# EAGLE design ESRMeterP (EAGLE 4.11)
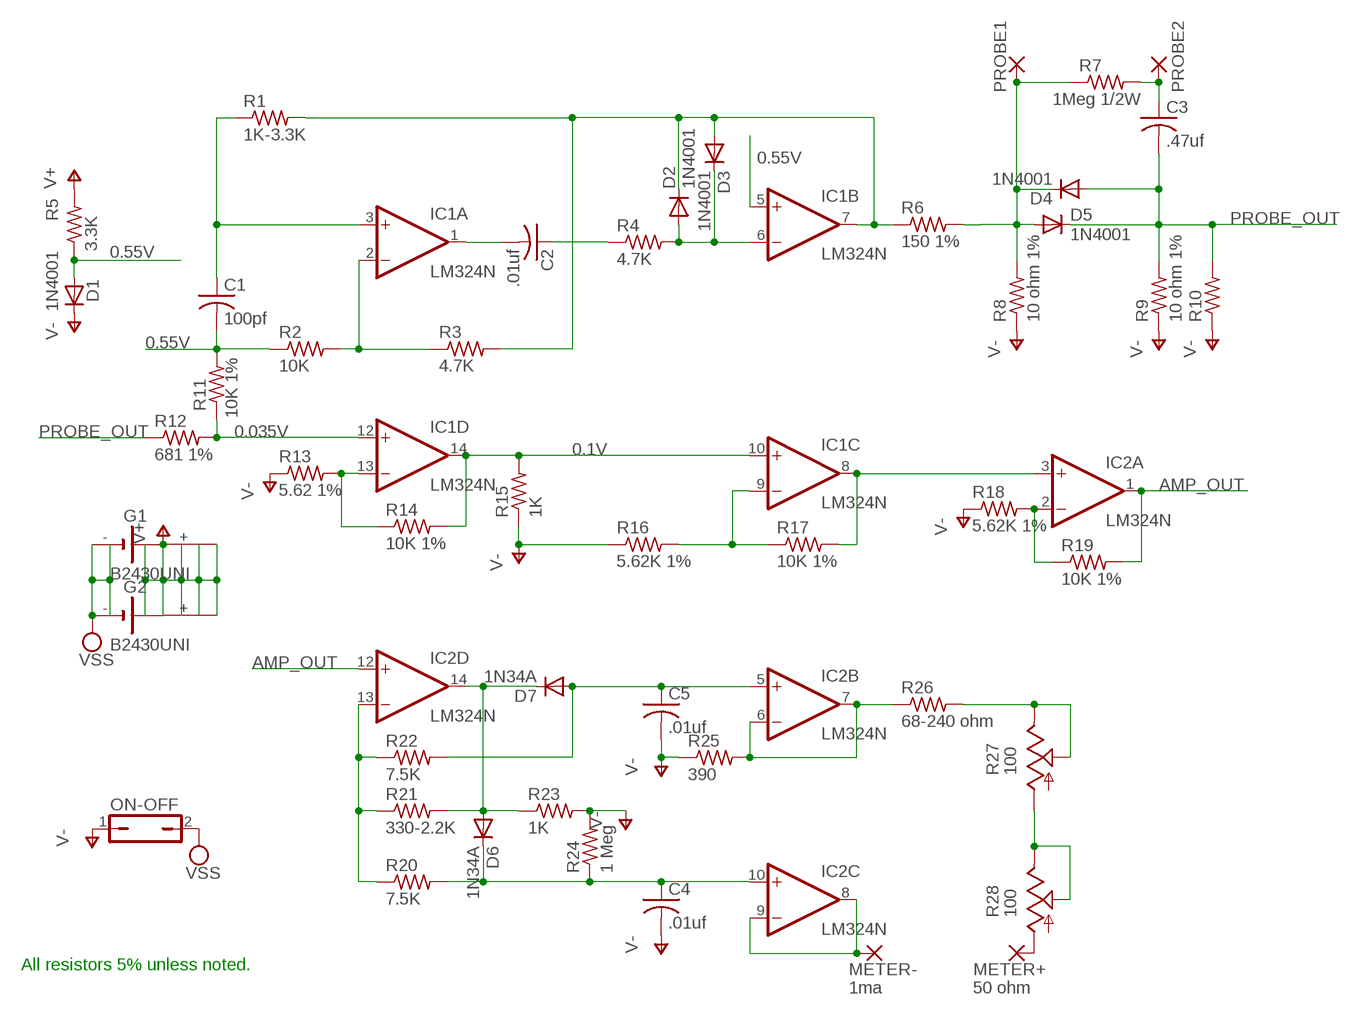
[diagram p0: schematic, sheet 1]

## Parts
C1  100pf  C-US050-025X075  [C050-025X075]
C2  .01uf  C-US050-025X075  [C050-025X075]
C3  .47uf  C-US075-052X106  [C075-052X106]
C4  .01uf  C-US050-025X075  [C050-025X075]
C5  .01uf  C-US050-025X075  [C050-025X075]
D1  1N4001  1N4004  [DO41-10]
D2  1N4001  1N4004  [DO41-10]
D3  1N4001  1N4004  [DO41-10]
D4  1N4001  1N4004  [DO41-10]
D5  1N4001  1N4004  [DO41-10]
D6  1N34A  1N4004  [DO41-10]
D7  1N34A  1N4004  [DO41-10]
G1  B2430UNI  [B2430UNI]
G2  B2430UNI  [B2430UNI]
IC1  LM324N  [DIL14]
IC2  LM324N  [DIL14]
METER+  50 ohm  2,15/1,0  [2,15/1,0]
METER-  1ma  2,15/1,0  [2,15/1,0]
ON-OFF  JP1Q  [JP1]
PROBE1  2,15/1,0  [2,15/1,0]
PROBE2  2,15/1,0  [2,15/1,0]
R1  1K-3.3K  R-US_0207/10  [0207/10]
R2  10K  R-US_0207/10  [0207/10]
R3  4.7K  R-US_0207/10  [0207/10]
R4  4.7K  R-US_0207/10  [0207/10]
R5  3.3K  R-US_0207/10  [0207/10]
R6  150 1%  R-US_0207/10  [0207/10]
R7  1Meg 1/2W  R-US_0207/12  [0207/12]
R8  10 ohm 1%  R-US_0207/10  [0207/10]
R9  10 ohm 1%  R-US_0207/10  [0207/10]
R10  R-US_0207/10  [0207/10]
R11  10K 1%  R-US_0207/10  [0207/10]
R12  681 1%  R-US_0207/10  [0207/10]
R13  5.62 1%  R-US_0207/10  [0207/10]
R14  10K 1%  R-US_0207/10  [0207/10]
R15  1K  R-US_0207/10  [0207/10]
R16  5.62K 1%  R-US_0207/10  [0207/10]
R17  10K 1%  R-US_0207/10  [0207/10]
R18  5.62K 1%  R-US_0207/10  [0207/10]
R19  10K 1%  R-US_0207/10  [0207/10]
R20  7.5K  R-US_0207/10  [0207/10]
R21  330-2.2K  R-US_0207/10  [0207/10]
R22  7.5K  R-US_0207/10  [0207/10]
R23  1K  R-US_0207/10  [0207/10]
R24  1 Meg  R-US_0207/12  [0207/12]
R25  390  R-US_0207/10  [0207/10]
R26  68-240 ohm  R-US_0207/10  [0207/10]
R27  100  TRIM_US-B64W  [B64W]
R28  100  TRIM_US-B64W  [B64W]

## Nets
0.1V: IC1.10(C:+IN) IC1.14(D:OUT) R14.2 R15.2
0.035V: IC1.12(D:+IN) R11.1 R12.2
0.55V: C1.2 D1.A IC1.5(B:+IN) R2.1 R5.1 R11.2
AMP_OUT: IC2.1(A:OUT) IC2.12(D:+IN) R19.2
N$1: D4.C D5.A PROBE1.1(P) R6.2 R7.1 R8.2
N$2: C1.1 IC1.3(A:+IN) R1.1
N$3: IC1.2(A:-IN) R2.2 R3.1
N$4: C2.2 IC1.1(A:OUT)
N$5: D2.C D3.A IC1.7(B:OUT) R1.2 R3.2 R6.1
N$6: C2.1 R4.1
N$7: C3.1 PROBE2.1(P) R7.2
N$8: D2.A D3.C IC1.6(B:-IN) R4.2
N$9: IC2.2(A:-IN) R18.2 R19.1
N$10: IC1.13(D:-IN) R13.2 R14.1
N$11: C5.1 D7.A IC2.5(B:+IN) R22.2
N$12: IC1.8(C:OUT) IC2.3(A:+IN) R17.2
N$13: IC1.9(C:-IN) R16.2 R17.1
N$14: IC2.13(D:-IN) R20.1 R21.1 R22.1
N$15: D6.A D7.C IC2.14(D:OUT) R21.2 R23.1
N$16: C4.1 D6.C IC2.10(C:+IN) R20.2 R24.1
N$17: IC2.6(B:-IN) IC2.7(B:OUT) R25.2 R26.1
N$18: IC2.8(C:OUT) IC2.9(C:-IN) METER-.1(P)
N$19: R26.2 R27.E R27.S
N$20: R27.A R28.E R28.S
N$21: METER+.1(P) R28.A
PROBE_OUT: C3.2 D4.A D5.C R9.2 R10.2 R12.1
V+: G1.+ G1.+@1(+) G1.+@2(+) G1.+@3(+) G1.+@4(+) G2.+ G2.+@1(+) G2.+@2(+) G2.+@3(+) G2.+@4(+) R5.2
V-: C4.2 C5.2 D1.C ON-OFF.1 R8.1 R9.1 R10.1 R13.1 R15.1 R16.1 R18.1 R23.2 R24.2 R25.1
VSS: G1.- G1.-@1(-) G2.- G2.-@1(-) ON-OFF.2

## Notes on the sheet
- All resistors 5% unless noted.

## Power pins joined to a net without a drawn wire
V+: IC1.4(P:V+) IC2.4(P:V+)
V-: IC1.11(P:V-) IC2.11(P:V-)

## Library data of the parts
C1-C5 = rcl:C-US: CAPACITOR, American symbol
D1-D7 = diode:1N4004: DIODE general purpose rectifier, 1 A
G1 G2 = battery:B2430UNI: LI BATTERY
IC1 IC2 = linear:LM324: OP AMP
METER+ METER- PROBE1 PROBE2 = wirepad:2,15/1,0: THROUGH-HOLE PAD
ON-OFF = jumper:JP1Q: JUMPER
R1-R26 = rcl:R-US_: RESISTOR, American symbol
R27 R28 = pot:TRIM_US-: POTENTIOMETER

## Board
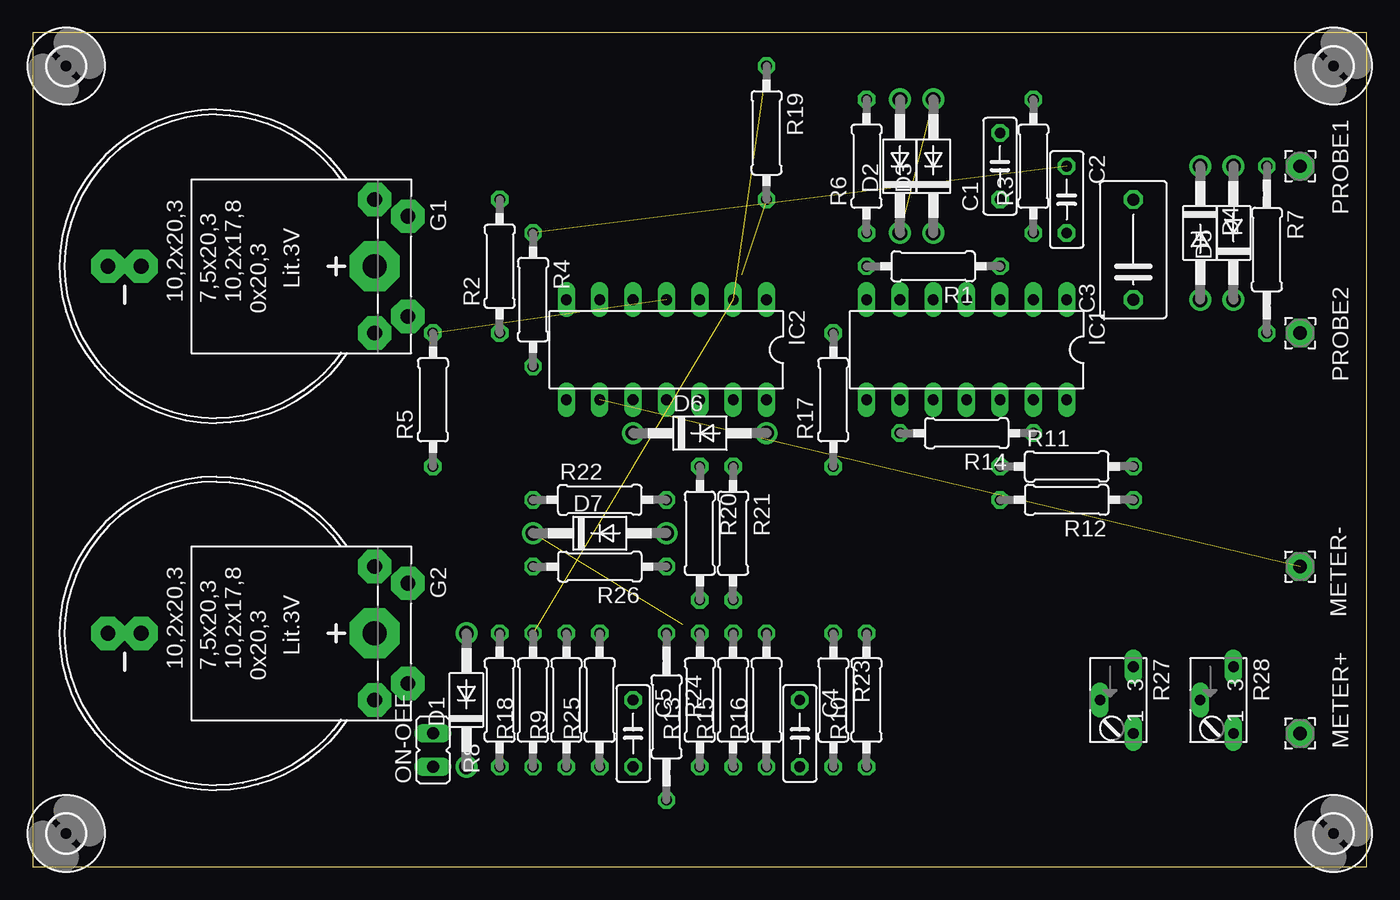
[diagram p1: board, top side]
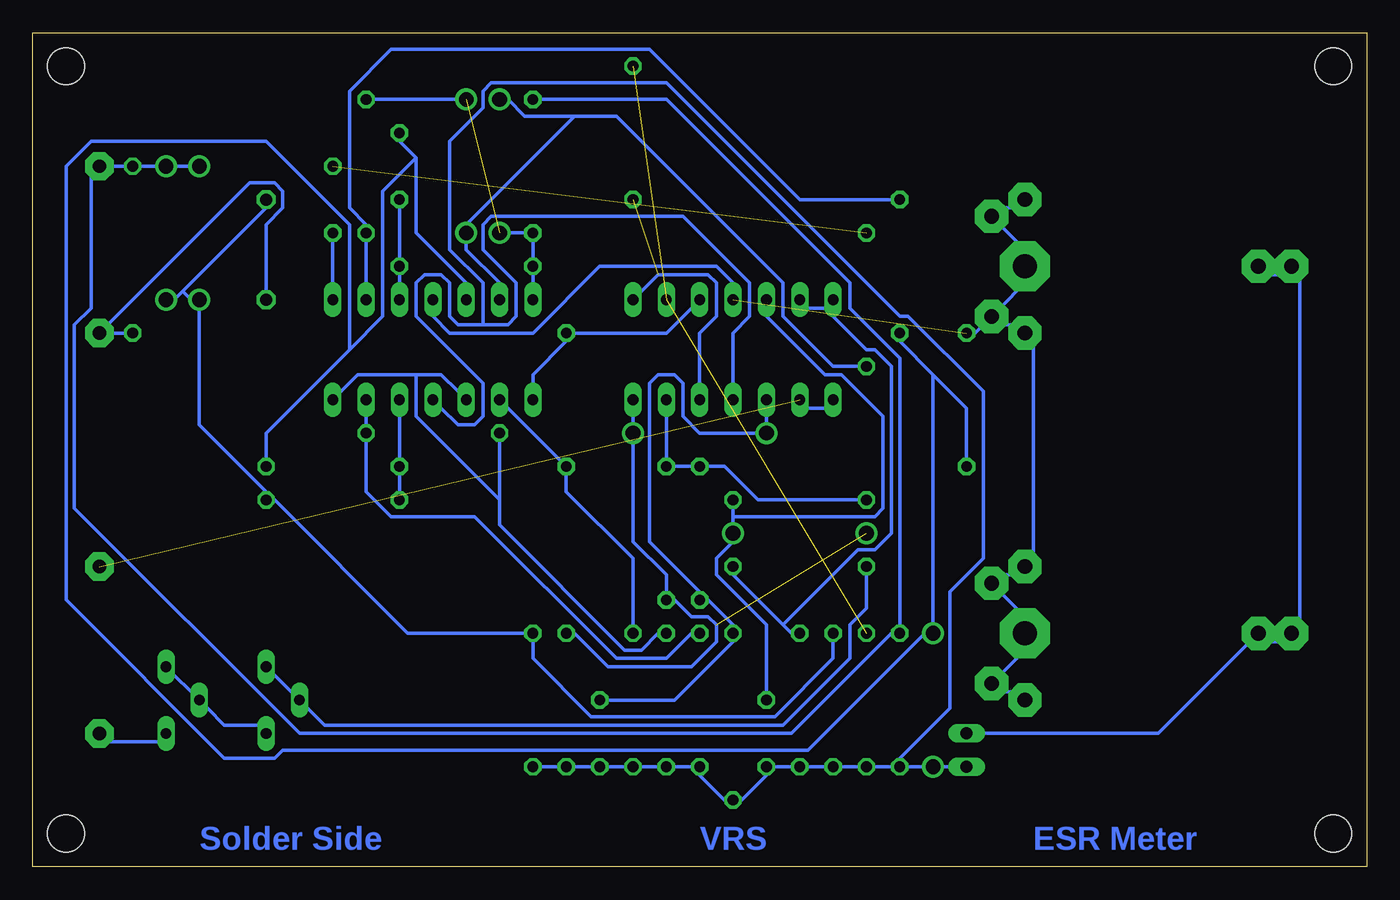
[diagram p2: board, bottom side, seen from below]

Size 101.58 x 63.49 mm. Coordinates in mm from the lower left corner, seen from the top.
Outline: 0,0 101.58,0 101.58,63.49 0,63.49 0,0
Copper layers (1*16): Top 0.035mm / dielectric 1.5mm / Bottom 0.035mm
Design rules "10mils": minimum track width 10mil, minimum drill 24mil, track to track 15mil, track to pad 10mil, pad to pad 10mil, via to via 10mil, smd to smd 10mil, copper to edge 40mil, drill to drill 10mil, minimum pad ring 10mil, minimum via ring 8mil, stop-mask expansion 0mil, vias tented up to drill 0mil, thermal gap 10mil

### Footprints (pad centres in the part's own frame; a part is rotated, then mirrored left to right if it is on the bottom)
C050-025X075 = drill 0.813 octagon: 1 -2.54,0; 2 2.54,0
C075-052X106 = drill 0.914 octagon: 1 -3.81,0; 2 3.81,0
DO41-10 = drill 1.118: A 5.08,0; C -5.08,0
B2430UNI = drill 1.118 pad 2.54 octagon: + 3.81,14.605; +@1 -3.81,14.605; +@2 -5.08,12.065; +@3 5.08,12.065; - 0,-5.715; -@1 0,-8.255 | drill 1.803 pad 3.81 octagon: +@4 0,12.065
DIL14 = drill 0.813 long: 1 -7.62,-3.81; 2 -5.08,-3.81; 3 -2.54,-3.81; 4 0,-3.81; 5 2.54,-3.81; 6 5.08,-3.81; 7 7.62,-3.81; 8 7.62,3.81; 9 5.08,3.81; 10 2.54,3.81; 11 0,3.81; 12 -2.54,3.81; 13 -5.08,3.81; 14 -7.62,3.81
2,15/1,0 = drill 1.016 pad 2.159 octagon: 1 0,0
JP1 = drill 0.914 long: 1 0,-1.27; 2 0,1.27
0207/10 = drill 0.813 octagon: 1 -5.08,0; 2 5.08,0
0207/12 = drill 0.813 octagon: 1 -6.35,0; 2 6.35,0
B64W = drill 0.813 long: A 2.54,0; E -2.54,0; S 0,-2.54
2,8 = hole 2.8: 0,0

### Placement (x,y rotation side)
C1  73.66,53.33 90 top
C2  78.73,50.79 270 top
C3  83.81,46.98 90 top
C4  58.41,10.15 270 top
C5  45.71,10.15 270 top
D1  33.02,12.69 90 top
D2  66.04,53.33 90 top
D3  68.58,53.33 90 top
D4  88.9,48.25 270 top
D5  91.44,48.25 90 top
D6  50.79,33.01 0 top
D7  43.17,25.39 0 top
G1  13.96,45.71 270 top
G2  13.96,17.77 270 top
IC1  71.12,39.36 180 top
IC2  48.25,39.36 180 top
METER+  96.52,10.15 180 top
METER-  96.52,22.85 180 top
ON-OFF  30.48,8.88 0 top
PROBE1  96.52,53.33 90 top
PROBE2  96.52,40.63 90 top
R1  68.58,45.71 180 top
R2  35.55,45.71 90 top
R3  76.2,53.33 90 top
R4  38.09,43.17 270 top
R5  30.48,35.55 90 top
R6  63.49,53.33 90 top
R7  93.98,46.98 270 top
R8  35.55,12.69 90 top
R9  40.63,12.69 90 top
R10  63.49,12.69 90 top
R11  78.73,30.47 0 top
R12  78.73,27.93 180 top
R13  50.79,12.69 90 top
R14  71.12,33.01 180 top
R15  53.34,12.69 90 top
R16  55.88,12.69 90 top
R17  60.95,35.55 90 top
R18  38.09,12.69 90 top
R19  55.88,55.87 270 top
R20  50.79,25.39 270 top
R21  53.34,25.39 270 top
R22  43.17,27.93 0 top
R23  60.95,12.69 270 top
R24  48.25,11.42 270 top
R25  43.17,12.69 90 top
R26  43.17,22.85 180 top
R27  83.81,12.69 270 top
R28  91.44,12.69 270 top
U$1  [2,8]  2.54,60.95 0 top
U$2  [2,8]  2.54,2.53 0 top
U$3  [2,8]  99.06,2.53 0 top
U$4  [2,8]  99.06,60.95 0 top

### Tracks (layer width: path | path; a pad name or v marks a point on that pad's centre or on a via)
0.1V
  Bottom 0.254: 72.39,37.46 76.83,37.46 78.1,36.19 IC1.14 | 72.39,37.46 70.48,37.46 69.21,36.19 IC1.10 | 66.04,27.93 66.04,32.38 R14.2 | 66.04,27.93 66.04,26.03 56.51,16.5 55.24,16.5 53.97,17.77 R15.2 | 72.39,37.46 72.39,34.28 66.04,27.93
0.035V
  Bottom 0.254: R12.2 73.66,28.57 73.66,29.84 R11.1 73.66,31.11 73.66,34.28 IC1.12
0.55V
  Bottom 0.254: 33.02,37.46 35.55,40 R2.1 | 33.02,37.46 30.48,34.92 30.48,31.11 R5.1 | 33.02,37.46 33.02,18.41 D1.A 33.65,17.77 42.54,8.88 82.55,8.88 83.18,8.25 86.99,8.25 99.06,20.31 99.06,53.33 97.15,55.24 83.81,55.24 77.47,48.89 77.47,39.36 | 72.39,53.97 72.39,48.25 68.58,44.44 IC1.5 | 72.39,53.97 73.66,55.24 C1.2 | 77.47,39.36 74.93,41.9 74.93,51.43 72.39,53.97 | 77.47,39.36 83.81,33.01 83.81,31.11 R11.2
AMP_OUT  (1 unrouted)
  Bottom 0.254: IC2.12 50.79,36.82 50.79,40.63 49.52,41.9 49.52,44.44 50.16,45.08 53.97,45.08 55.24,43.81 IC2.1
N$1
  Bottom 0.254: D4.C 89.53,53.33 90.8,53.33 D5.A 92.07,53.33 93.34,53.33 R7.1 94.61,53.33 95.88,53.33 PROBE1.1 97.15,52.7 97.15,42.54 98.42,41.27 98.42,27.3 81.28,10.15 43.81,10.15 36.19,17.77 R8.2 35.55,18.41 35.55,38.73 39.36,42.54 39.36,44.44 53.34,58.41 62.86,58.41 R6.2
N$2
  Bottom 0.254: IC1.3 73.66,44.44 73.66,45.08 R1.1 73.66,46.35 73.66,50.16 C1.1
N$3
  Bottom 0.254: R2.2 36.19,50.79 43.17,50.79 54.6,62.22 74.29,62.22 77.47,59.05 77.47,50.16 76.2,48.89 R3.1 76.2,47.62 76.2,44.44 IC1.2
N$4
  Bottom 0.254: IC1.1 78.73,44.44 78.73,47.62 C2.2
N$5  (1 unrouted)
  Bottom 0.254: IC1.7 63.49,44.44 63.49,45.08 R1.2 63.49,46.35 63.49,47.62 R6.1 64.13,48.25 65.4,48.25 D2.C | R3.2 75.56,58.41 69.21,58.41 D3.A
N$6  (1 unrouted)
N$7
  Bottom 0.254: R7.2 94.61,40.63 95.88,40.63 PROBE2.1 95.88,41.27 85.09,52.06 83.18,52.06 82.55,51.43 82.55,50.16 83.81,48.89 83.81,43.81 C3.1
N$8
  Bottom 0.254: IC1.6 66.04,44.44 68.58,46.98 68.58,47.62 D3.C 68.58,48.89 60.32,57.14 | 60.32,57.14 64.13,57.14 65.4,58.41 D2.A | 60.32,57.14 57.14,57.14 44.45,44.44 44.45,41.9 40.63,38.09 38.73,38.09 R4.2
N$9  (2 unrouted)
N$10
  Bottom 0.254: R13.2 51.43,17.77 53.34,15.87 57.14,15.87 67.94,26.66 74.29,26.66 76.2,28.57 76.2,32.38 R14.1 76.2,33.65 76.2,34.28 IC1.13
N$11
  Bottom 0.254: C5.1 45.71,13.33 45.71,18.41 49.52,22.22 49.52,23.49 48.25,24.76 D7.A 48.25,26.03 48.25,26.66 | 48.25,26.66 48.25,27.3 R22.2 | 48.25,26.66 37.46,26.66 36.82,27.3 36.82,34.28 40,37.46 41.27,37.46 45.71,41.9 IC2.5
N$12
  Bottom 0.254: IC1.8 63.49,36.82 63.49,37.46 60.95,40 R17.2 60.32,40.63 53.34,40.63 51.43,42.54 IC2.3
N$13
  Bottom 0.254: R16.2 55.88,18.41 55.88,23.49 60.95,28.57 60.95,29.84 R17.1 65.4,34.92 IC1.9
N$14
  Bottom 0.254: R22.1 38.73,27.93 46.35,27.93 48.89,30.47 50.16,30.47 R20.1 51.43,30.47 52.7,30.47 R21.1 53.34,31.11 53.34,34.28 IC2.13
N$15  (1 unrouted)
  Bottom 0.254: R23.1 60.32,17.77 57.78,15.23 51.43,15.23 49.52,17.14 49.52,18.41 50.16,19.04 51.43,19.04 52.7,20.31 R21.2 53.34,20.95 53.34,22.22 55.88,24.76 55.88,32.38 D6.A 55.88,33.65 55.88,34.28 IC2.14
N$16
  Bottom 0.254: IC2.10 45.71,34.28 45.71,33.65 D6.C 46.35,33.01 50.79,33.01 52.06,34.28 52.06,36.82 52.7,37.46 53.97,37.46 54.6,36.82 54.6,24.76 50.79,20.95 R20.2 50.16,20.31 48.25,18.41 R24.1 48.25,17.14 52.7,12.69 57.78,12.69 C4.1
N$17
  Bottom 0.254: IC2.6 42.54,42.54 41.27,42.54 IC2.7 40.63,41.9 38.09,39.36 37.46,39.36 36.19,38.09 36.19,25.39 37.46,24.12 38.73,24.12 44.45,18.41 | 44.45,18.41 48.25,22.22 R26.1 | 44.45,18.41 43.81,17.77 R25.2
N$18  (1 unrouted)
  Bottom 0.254: IC2.8 41.27,34.92 42.54,34.92 IC2.9
N$19
  Bottom 0.254: R27.E 83.18,14.6 81.91,13.33 R27.S 80.64,12.06 79.37,10.79 44.45,10.79 39.36,15.87 39.36,18.41 38.09,19.68 38.09,22.22 R26.2
N$20
  Bottom 0.254: R27.A 84.45,10.79 86.99,10.79 88.26,12.06 R28.S 89.53,13.33 90.8,14.6 R28.E
N$21
  Bottom 0.254: R28.A 92.07,9.52 95.88,9.52 METER+.1
PROBE_OUT
  Bottom 0.254: R9.2 40.63,17.14 40.63,15.87 45.08,11.42 59.05,11.42 63.49,15.87 63.49,17.14 R10.2 64.13,17.77 73.02,17.77 83.18,27.93 R12.1 83.81,28.57 88.9,33.65 88.9,42.54 D4.A 89.53,43.17 90.17,43.81 | 90.17,43.81 90.8,43.17 D5.C | 90.17,43.81 83.81,50.16 C3.2
V+  (1 unrouted)
  Bottom 0.254: G2.+@3 26.67,13.33 27.94,13.33 G2.+ 27.94,14.6 26.03,16.5 G2.+@4 26.03,19.04 27.94,20.95 G2.+@1 27.94,22.22 26.67,22.22 G2.+@2 25.39,23.49 25.39,40 G1.+@3 26.67,41.27 27.94,41.27 G1.+ | R5.2 29.84,40.63 29.21,41.27 G1.+ | G1.+@2 26.67,50.16 27.94,50.16 G1.+@1 27.94,48.89 26.03,46.98 G1.+@4 26.03,44.44 27.94,42.54 G1.+ | IC2.4 48.25,44.44 49.52,45.71 58.41,45.71 63.49,40.63 69.84,40.63 71.12,41.9 IC1.4
V-
  Bottom 0.254: 67.31,41.27 69.21,41.27 69.84,41.9 69.84,44.44 70.48,45.08 71.75,45.08 72.39,44.44 72.39,41.9 67.31,36.82 67.31,34.28 67.94,33.65 69.21,33.65 70.48,34.92 IC1.11 | 67.31,41.27 65.4,41.27 64.77,41.9 64.77,44.44 67.31,46.98 67.31,48.89 66.67,49.52 52.06,49.52 46.98,44.44 46.98,41.9 48.25,40.63 48.25,36.82 IC2.11 | R10.1 62.86,7.61 61.59,7.61 R23.2 60.32,7.61 59.05,7.61 C4.2 57.78,7.61 56.51,7.61 R16.1 55.24,7.61 53.97,7.61 R15.1 52.7,7.61 51.43,7.61 R13.1 50.79,6.98 48.89,5.07 R24.2 47.62,5.07 45.71,6.98 C5.2 45.08,7.61 43.81,7.61 R25.1 42.54,7.61 41.27,7.61 R9.1 40,7.61 38.73,7.61 R18.1 37.46,7.61 36.19,7.61 R8.1 | R8.1 34.92,7.61 33.65,7.61 D1.C 32.38,7.61 31.75,7.61 ON-OFF.1 | 67.31,41.27 67.31,44.44 69.84,46.98 69.84,55.24 67.31,57.78 67.31,59.05 66.67,59.68 53.34,59.68 35.55,41.9 34.92,41.9 29.21,36.19 29.21,23.49 31.75,20.95 31.75,12.06 35.55,8.25 R8.1
VSS
  Bottom 0.254: G1.- 7.62,45.08 6.34,45.08 G1.-@1 5.08,45.08 5.08,18.41 G2.-@1 6.34,17.14 7.62,17.14 G2.- 8.88,17.14 15.87,10.15 29.21,10.15 ON-OFF.2

### Text on the board
Bottom: ESR Meter | VRS | Solder Side